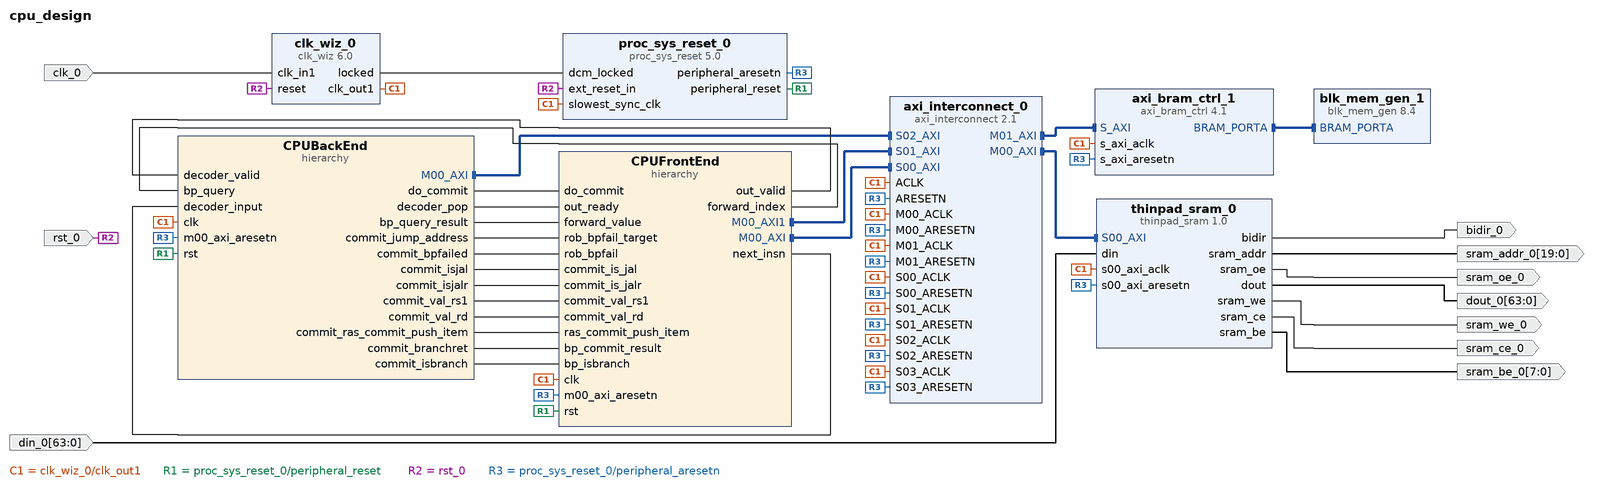
[diagram p0: block diagram of the top level]
# Vivado block design cpu_design, xc7a100tfgg676-2L, Vivado 2019.1
create_bd_design cpu_design

create_bd_port -dir I -type clk clk_0
set_property -dict {CONFIG.FREQ_HZ 50000000} [get_bd_ports clk_0]
create_bd_port -dir I -type rst rst_0
set_property -dict {CONFIG.POLARITY ACTIVE_HIGH} [get_bd_ports rst_0]
create_bd_port -dir O sram_oe_0
create_bd_port -dir O sram_we_0
create_bd_port -dir O -from 19 -to 0 sram_addr_0
create_bd_port -dir O bidir_0
create_bd_port -dir O sram_ce_0
create_bd_port -dir O -from 63 -to 0 dout_0
create_bd_port -dir O -from 7 -to 0 sram_be_0
create_bd_port -dir I -from 63 -to 0 din_0

create_bd_cell -type ip -vlnv xilinx.com:ip:clk_wiz:6.0 clk_wiz_0
set_property -dict [list \
  CONFIG.CLKIN1_JITTER_PS 200.0 \
  CONFIG.CLKOUT1_JITTER 162.035 \
  CONFIG.CLKOUT1_PHASE_ERROR 164.985 \
  CONFIG.MMCM_CLKFBOUT_MULT_F 20.000 \
  CONFIG.MMCM_CLKIN1_PERIOD 20.000 \
  CONFIG.MMCM_CLKIN2_PERIOD 10.0 \
  CONFIG.PRIM_IN_FREQ 50.000 \
] [get_bd_cells clk_wiz_0]
create_bd_cell -type ip -vlnv xilinx.com:ip:proc_sys_reset:5.0 proc_sys_reset_0
create_bd_cell -type hier CPUFrontEnd
create_bd_cell -type hier CPUBackEnd
create_bd_cell -type ip -vlnv xilinx.com:ip:axi_bram_ctrl:4.1 axi_bram_ctrl_1
set_property -dict {CONFIG.DATA_WIDTH 64 CONFIG.SINGLE_PORT_BRAM 1} [get_bd_cells axi_bram_ctrl_1]
create_bd_cell -type ip -vlnv xilinx.com:ip:blk_mem_gen:8.4 blk_mem_gen_1
set_property -dict [list \
  CONFIG.Load_Init_File false \
  CONFIG.Memory_Type Single_Port_ROM \
  CONFIG.Port_A_Write_Rate 0 \
] [get_bd_cells blk_mem_gen_1]
create_bd_cell -type ip -vlnv xilinx.com:ip:axi_interconnect:2.1 axi_interconnect_0
set_property -dict {CONFIG.NUM_MI 2 CONFIG.NUM_SI 4} [get_bd_cells axi_interconnect_0]
create_bd_cell -type ip -vlnv xilinx.com:user:thinpad_sram:1.0 thinpad_sram_0

# ---- hierarchy /CPUFrontEnd ----
current_bd_instance /CPUFrontEnd
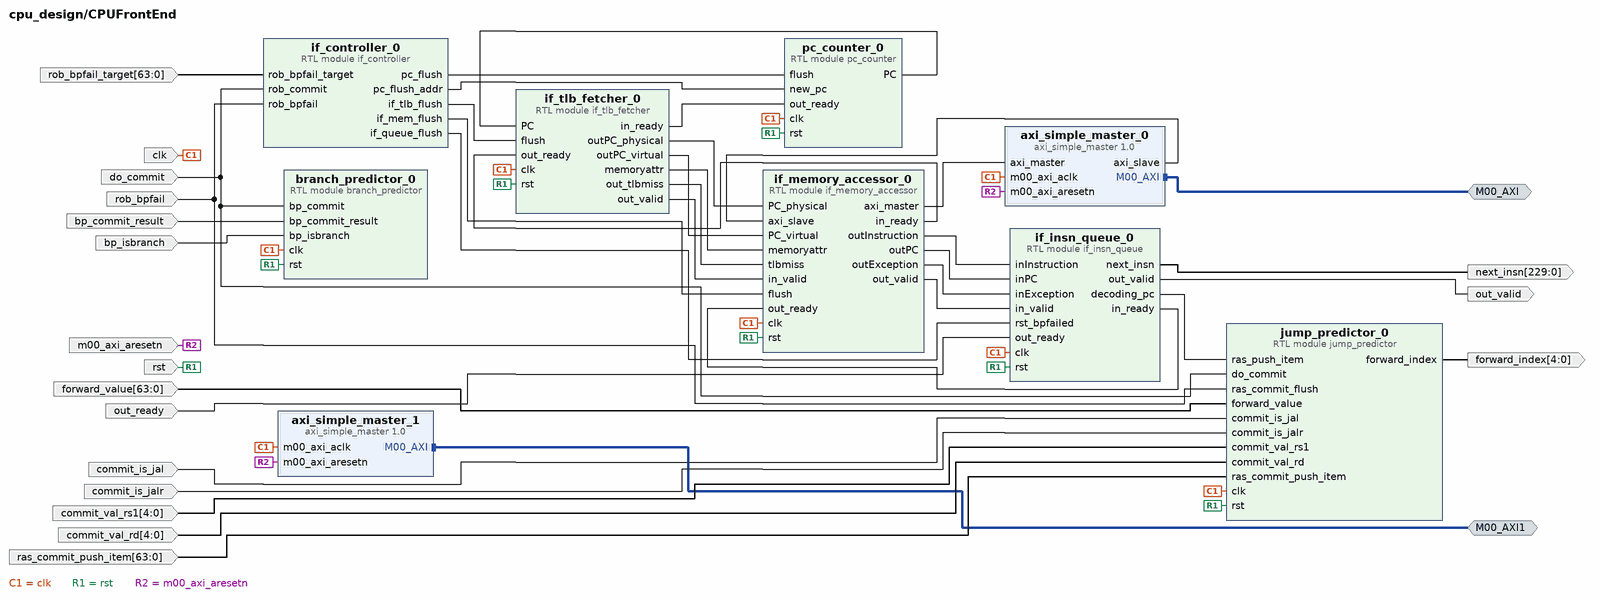
[diagram p1: block diagram inside /CPUFrontEnd]
create_bd_intf_pin -mode Master -vlnv xilinx.com:interface:aximm_rtl:1.0 M00_AXI1
create_bd_intf_pin -mode Master -vlnv xilinx.com:interface:aximm_rtl:1.0 M00_AXI
create_bd_pin -dir I do_commit
create_bd_pin -dir I rob_bpfail
create_bd_pin -dir I -from 63 -to 0 rob_bpfail_target
create_bd_pin -dir I -type clk clk
create_bd_pin -dir I -type rst rst
create_bd_pin -dir O -from 4 -to 0 forward_index
create_bd_pin -dir I -from 63 -to 0 forward_value
create_bd_pin -dir O out_valid
create_bd_pin -dir I out_ready
create_bd_pin -dir O -from 229 -to 0 next_insn
create_bd_pin -dir I -type rst m00_axi_aresetn
create_bd_pin -dir I commit_is_jal
create_bd_pin -dir I commit_is_jalr
create_bd_pin -dir I -from 4 -to 0 commit_val_rs1
create_bd_pin -dir I -from 4 -to 0 commit_val_rd
create_bd_pin -dir I -from 63 -to 0 ras_commit_push_item
create_bd_pin -dir I bp_commit_result
create_bd_pin -dir I bp_isbranch

create_bd_cell -type ip -vlnv xilinx.com:user:axi_simple_master:1.0 axi_simple_master_0
create_bd_cell -type ip -vlnv xilinx.com:user:axi_simple_master:1.0 axi_simple_master_1
create_bd_cell -type module -reference pc_counter pc_counter_0
create_bd_cell -type module -reference if_tlb_fetcher if_tlb_fetcher_0
create_bd_cell -type module -reference if_memory_accessor if_memory_accessor_0
create_bd_cell -type module -reference if_insn_queue if_insn_queue_0
create_bd_cell -type module -reference jump_predictor jump_predictor_0
create_bd_cell -type module -reference branch_predictor branch_predictor_0
create_bd_cell -type module -reference if_controller if_controller_0

# ---- hierarchy /CPUBackEnd ----
current_bd_instance /CPUBackEnd
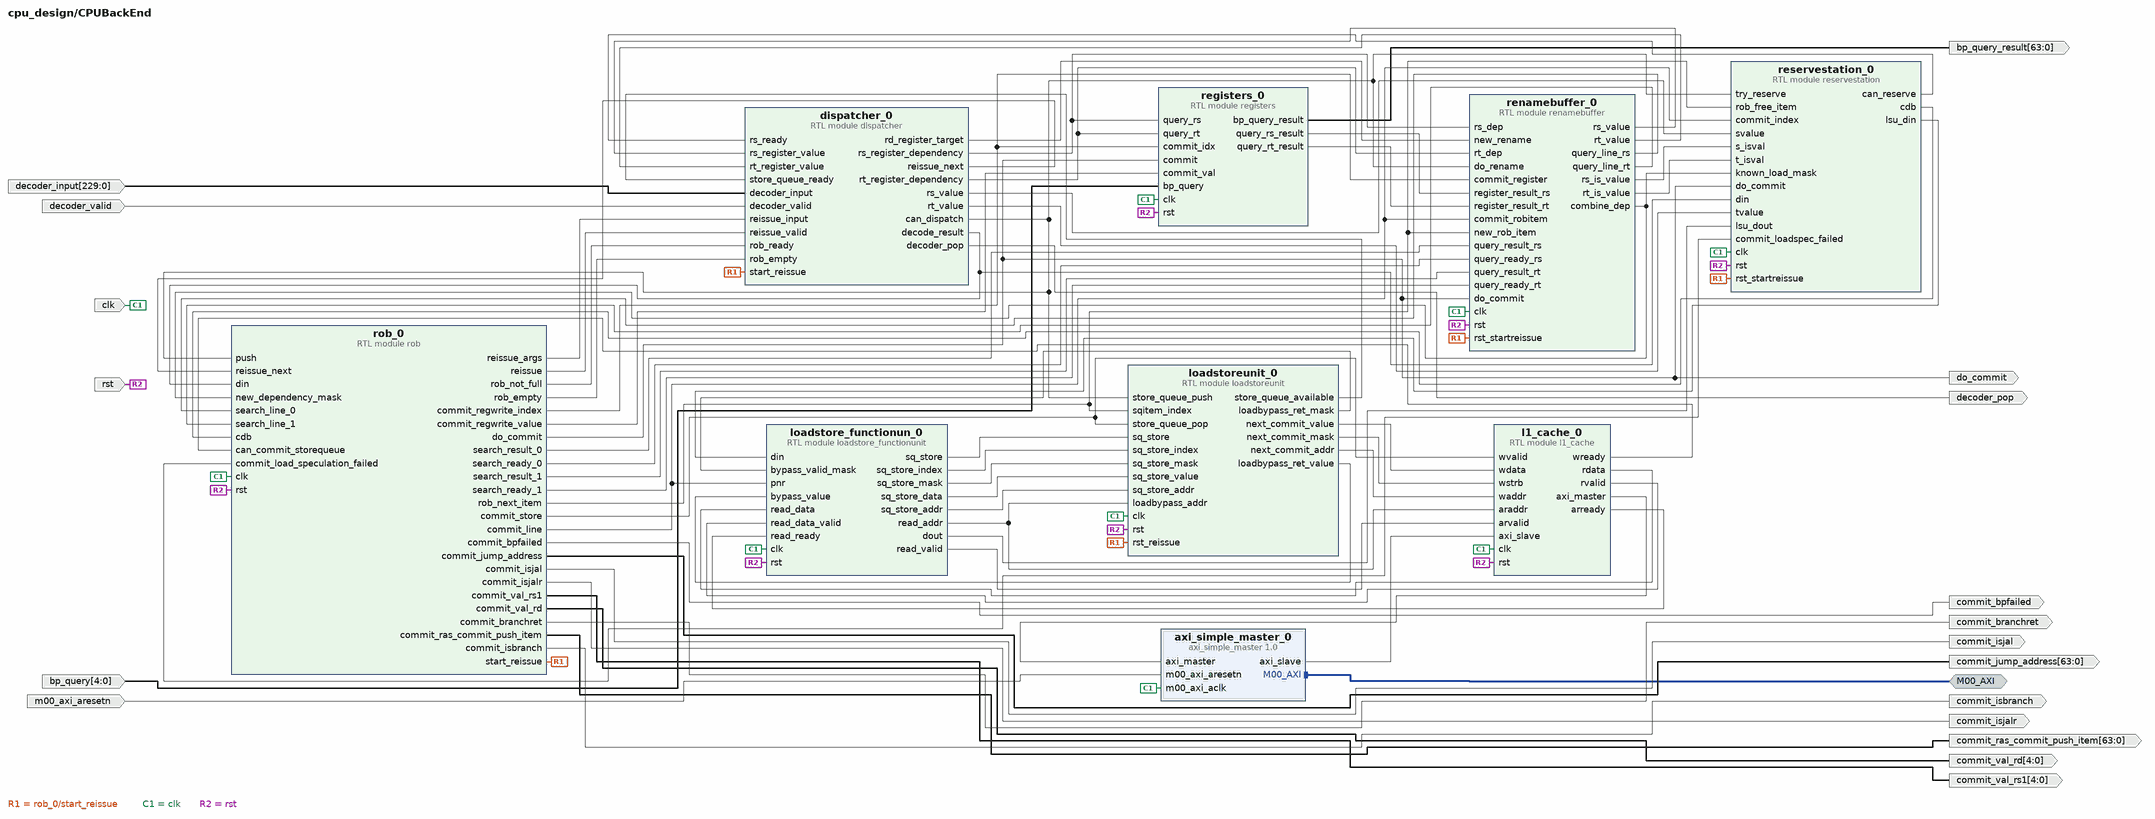
[diagram p2: block diagram inside /CPUBackEnd]
create_bd_intf_pin -mode Master -vlnv xilinx.com:interface:aximm_rtl:1.0 M00_AXI
create_bd_pin -dir I -from 229 -to 0 decoder_input
create_bd_pin -dir I decoder_valid
create_bd_pin -dir O decoder_pop
create_bd_pin -dir I -type clk clk
create_bd_pin -dir I -type rst rst
create_bd_pin -dir O do_commit
create_bd_pin -dir I -from 4 -to 0 bp_query
create_bd_pin -dir O -from 63 -to 0 bp_query_result
create_bd_pin -dir O -from 63 -to 0 commit_jump_address
create_bd_pin -dir O commit_bpfailed
create_bd_pin -dir I -type rst m00_axi_aresetn
create_bd_pin -dir O commit_isjal
create_bd_pin -dir O commit_isjalr
create_bd_pin -dir O -from 4 -to 0 commit_val_rs1
create_bd_pin -dir O -from 4 -to 0 commit_val_rd
create_bd_pin -dir O -from 63 -to 0 commit_ras_commit_push_item
create_bd_pin -dir O commit_branchret
create_bd_pin -dir O commit_isbranch

create_bd_cell -type ip -vlnv xilinx.com:user:axi_simple_master:1.0 axi_simple_master_0
create_bd_cell -type module -reference dispatcher dispatcher_0
create_bd_cell -type module -reference l1_cache l1_cache_0
create_bd_cell -type module -reference loadstoreunit loadstoreunit_0
create_bd_cell -type module -reference registers registers_0
create_bd_cell -type module -reference renamebuffer renamebuffer_0
create_bd_cell -type module -reference rob rob_0
create_bd_cell -type module -reference reservestation reservestation_0
create_bd_cell -type module -reference loadstore_functionunit loadstore_functionun_0

# ---- connections ----

current_bd_instance /CPUFrontEnd
connect_bd_intf_net [get_bd_intf_pins M00_AXI] [get_bd_intf_pins axi_simple_master_0/M00_AXI]
connect_bd_intf_net [get_bd_intf_pins M00_AXI1] [get_bd_intf_pins axi_simple_master_1/M00_AXI]
connect_bd_net [get_bd_pins if_controller_0/pc_flush] [get_bd_pins pc_counter_0/flush]
connect_bd_net [get_bd_pins if_controller_0/pc_flush_addr] [get_bd_pins pc_counter_0/new_pc]
connect_bd_net [get_bd_pins if_controller_0/if_tlb_flush] [get_bd_pins if_tlb_fetcher_0/flush]
connect_bd_net [get_bd_pins if_controller_0/if_mem_flush] [get_bd_pins if_memory_accessor_0/flush]
connect_bd_net [get_bd_pins if_controller_0/if_queue_flush] [get_bd_pins if_insn_queue_0/rst_bpfailed]
connect_bd_net [get_bd_pins pc_counter_0/PC] [get_bd_pins if_tlb_fetcher_0/PC]
connect_bd_net [get_bd_pins if_tlb_fetcher_0/outPC_physical] [get_bd_pins if_memory_accessor_0/PC_physical]
connect_bd_net [get_bd_pins if_tlb_fetcher_0/outPC_virtual] [get_bd_pins if_memory_accessor_0/PC_virtual]
connect_bd_net [get_bd_pins if_tlb_fetcher_0/memoryattr] [get_bd_pins if_memory_accessor_0/memoryattr]
connect_bd_net [get_bd_pins if_tlb_fetcher_0/out_tlbmiss] [get_bd_pins if_memory_accessor_0/tlbmiss]
connect_bd_net [get_bd_pins if_tlb_fetcher_0/in_ready] [get_bd_pins pc_counter_0/out_ready]
connect_bd_net [get_bd_pins if_tlb_fetcher_0/out_valid] [get_bd_pins if_memory_accessor_0/in_valid]
connect_bd_net [get_bd_pins if_memory_accessor_0/in_ready] [get_bd_pins if_tlb_fetcher_0/out_ready]
connect_bd_net [get_bd_pins if_memory_accessor_0/outInstruction] [get_bd_pins if_insn_queue_0/inInstruction]
connect_bd_net [get_bd_pins if_memory_accessor_0/outPC] [get_bd_pins if_insn_queue_0/inPC]
connect_bd_net [get_bd_pins if_memory_accessor_0/outException] [get_bd_pins if_insn_queue_0/inException]
connect_bd_net [get_bd_pins if_memory_accessor_0/out_valid] [get_bd_pins if_insn_queue_0/in_valid]
connect_bd_net [get_bd_pins if_insn_queue_0/in_ready] [get_bd_pins if_memory_accessor_0/out_ready]
connect_bd_net -net rob_0_do_commit [get_bd_pins do_commit] \
  [get_bd_pins jump_predictor_0/do_commit] [get_bd_pins branch_predictor_0/bp_commit] \
  [get_bd_pins if_controller_0/rob_commit]
connect_bd_net -net rob_0_commit_bpfailed [get_bd_pins rob_bpfail] \
  [get_bd_pins jump_predictor_0/ras_commit_flush] [get_bd_pins if_controller_0/rob_bpfail]
connect_bd_net -net rob_0_commit_jump_address [get_bd_pins rob_bpfail_target] [get_bd_pins if_controller_0/rob_bpfail_target]
connect_bd_net -net clk_0_1 [get_bd_pins clk] \
  [get_bd_pins axi_simple_master_0/m00_axi_aclk] [get_bd_pins axi_simple_master_1/m00_axi_aclk] \
  [get_bd_pins pc_counter_0/clk] [get_bd_pins if_tlb_fetcher_0/clk] [get_bd_pins if_memory_accessor_0/clk] \
  [get_bd_pins if_insn_queue_0/clk] [get_bd_pins jump_predictor_0/clk] [get_bd_pins branch_predictor_0/clk]
connect_bd_net -net rst_0_1 [get_bd_pins rst] \
  [get_bd_pins pc_counter_0/rst] [get_bd_pins if_tlb_fetcher_0/rst] [get_bd_pins if_memory_accessor_0/rst] \
  [get_bd_pins if_insn_queue_0/rst] [get_bd_pins jump_predictor_0/rst] [get_bd_pins branch_predictor_0/rst]
connect_bd_net [get_bd_pins jump_predictor_0/forward_index] [get_bd_pins forward_index]
connect_bd_net -net registers_0_bp_query_result [get_bd_pins forward_value] [get_bd_pins jump_predictor_0/forward_value]
connect_bd_net [get_bd_pins if_insn_queue_0/out_valid] [get_bd_pins out_valid]
connect_bd_net -net dispatcher_0_decoder_pop [get_bd_pins out_ready] [get_bd_pins if_insn_queue_0/out_ready]
connect_bd_net [get_bd_pins if_insn_queue_0/next_insn] [get_bd_pins next_insn]
connect_bd_net [get_bd_pins m00_axi_aresetn] [get_bd_pins axi_simple_master_0/m00_axi_aresetn] [get_bd_pins axi_simple_master_1/m00_axi_aresetn]
connect_bd_net [get_bd_pins if_memory_accessor_0/axi_master] [get_bd_pins axi_simple_master_0/axi_master]
connect_bd_net [get_bd_pins axi_simple_master_0/axi_slave] [get_bd_pins if_memory_accessor_0/axi_slave]
connect_bd_net [get_bd_pins commit_is_jal] [get_bd_pins jump_predictor_0/commit_is_jal]
connect_bd_net [get_bd_pins commit_is_jalr] [get_bd_pins jump_predictor_0/commit_is_jalr]
connect_bd_net -net commit_val_rs1_1 [get_bd_pins commit_val_rs1] [get_bd_pins jump_predictor_0/commit_val_rs1]
connect_bd_net [get_bd_pins commit_val_rd] [get_bd_pins jump_predictor_0/commit_val_rd]
connect_bd_net [get_bd_pins ras_commit_push_item] [get_bd_pins jump_predictor_0/ras_commit_push_item]
connect_bd_net [get_bd_pins bp_commit_result] [get_bd_pins branch_predictor_0/bp_commit_result]
connect_bd_net [get_bd_pins bp_isbranch] [get_bd_pins branch_predictor_0/bp_isbranch]
connect_bd_net [get_bd_pins if_insn_queue_0/decoding_pc] [get_bd_pins jump_predictor_0/ras_push_item]

current_bd_instance /CPUBackEnd
connect_bd_intf_net [get_bd_intf_pins M00_AXI] [get_bd_intf_pins axi_simple_master_0/M00_AXI]
connect_bd_net [get_bd_pins rob_0/reissue_args] [get_bd_pins dispatcher_0/reissue_input]
connect_bd_net [get_bd_pins rob_0/reissue] [get_bd_pins dispatcher_0/reissue_valid]
connect_bd_net [get_bd_pins dispatcher_0/reissue_next] [get_bd_pins rob_0/reissue_next]
connect_bd_net [get_bd_pins dispatcher_0/can_dispatch] \
  [get_bd_pins loadstoreunit_0/store_queue_push] [get_bd_pins renamebuffer_0/do_rename] [get_bd_pins rob_0/push] \
  [get_bd_pins reservestation_0/try_reserve]
connect_bd_net [get_bd_pins rob_0/rob_not_full] [get_bd_pins dispatcher_0/rob_ready]
connect_bd_net [get_bd_pins reservestation_0/can_reserve] [get_bd_pins dispatcher_0/rs_ready]
connect_bd_net [get_bd_pins dispatcher_0/decode_result] [get_bd_pins rob_0/din] [get_bd_pins reservestation_0/din]
connect_bd_net [get_bd_pins dispatcher_0/rs_register_dependency] [get_bd_pins registers_0/query_rs] [get_bd_pins renamebuffer_0/rs_dep]
connect_bd_net [get_bd_pins dispatcher_0/rt_register_dependency] [get_bd_pins registers_0/query_rt] [get_bd_pins renamebuffer_0/rt_dep]
connect_bd_net [get_bd_pins dispatcher_0/rd_register_target] [get_bd_pins renamebuffer_0/new_rename]
connect_bd_net [get_bd_pins renamebuffer_0/rs_value] [get_bd_pins dispatcher_0/rs_register_value]
connect_bd_net [get_bd_pins renamebuffer_0/rt_value] [get_bd_pins dispatcher_0/rt_register_value]
connect_bd_net [get_bd_pins dispatcher_0/rs_value] [get_bd_pins reservestation_0/svalue]
connect_bd_net [get_bd_pins dispatcher_0/rt_value] [get_bd_pins reservestation_0/tvalue]
connect_bd_net [get_bd_pins rob_0/start_reissue] \
  [get_bd_pins dispatcher_0/start_reissue] [get_bd_pins loadstoreunit_0/rst_reissue] \
  [get_bd_pins renamebuffer_0/rst_startreissue] [get_bd_pins reservestation_0/rst_startreissue]
connect_bd_net [get_bd_pins rob_0/rob_empty] [get_bd_pins dispatcher_0/rob_empty]
connect_bd_net [get_bd_pins loadstoreunit_0/store_queue_available] [get_bd_pins dispatcher_0/store_queue_ready]
connect_bd_net [get_bd_pins registers_0/query_rs_result] [get_bd_pins renamebuffer_0/register_result_rs]
connect_bd_net [get_bd_pins registers_0/query_rt_result] [get_bd_pins renamebuffer_0/register_result_rt]
connect_bd_net [get_bd_pins rob_0/commit_regwrite_index] [get_bd_pins registers_0/commit_idx] [get_bd_pins renamebuffer_0/commit_register]
connect_bd_net [get_bd_pins rob_0/commit_regwrite_value] [get_bd_pins registers_0/commit_val]
connect_bd_net [get_bd_pins rob_0/rob_next_item] \
  [get_bd_pins loadstoreunit_0/sqitem_index] [get_bd_pins renamebuffer_0/new_rob_item] \
  [get_bd_pins reservestation_0/rob_free_item]
connect_bd_net [get_bd_pins rob_0/commit_line] \
  [get_bd_pins renamebuffer_0/commit_robitem] [get_bd_pins reservestation_0/commit_index] \
  [get_bd_pins loadstore_functionun_0/pnr]
connect_bd_net [get_bd_pins renamebuffer_0/combine_dep] [get_bd_pins rob_0/new_dependency_mask] [get_bd_pins reservestation_0/known_load_mask]
connect_bd_net [get_bd_pins renamebuffer_0/rs_is_value] [get_bd_pins reservestation_0/s_isval]
connect_bd_net [get_bd_pins renamebuffer_0/rt_is_value] [get_bd_pins reservestation_0/t_isval]
connect_bd_net [get_bd_pins renamebuffer_0/query_line_rs] [get_bd_pins rob_0/search_line_0]
connect_bd_net [get_bd_pins rob_0/search_result_0] [get_bd_pins renamebuffer_0/query_result_rs]
connect_bd_net [get_bd_pins rob_0/search_ready_0] [get_bd_pins renamebuffer_0/query_ready_rs]
connect_bd_net [get_bd_pins renamebuffer_0/query_line_rt] [get_bd_pins rob_0/search_line_1]
connect_bd_net [get_bd_pins rob_0/search_result_1] [get_bd_pins renamebuffer_0/query_result_rt]
connect_bd_net [get_bd_pins rob_0/search_ready_1] [get_bd_pins renamebuffer_0/query_ready_rt]
connect_bd_net [get_bd_pins reservestation_0/cdb] [get_bd_pins rob_0/cdb]
connect_bd_net [get_bd_pins rob_0/commit_store] [get_bd_pins l1_cache_0/wvalid] [get_bd_pins loadstoreunit_0/store_queue_pop]
connect_bd_net -net if_insn_queue_0_next_insn [get_bd_pins decoder_input] [get_bd_pins dispatcher_0/decoder_input]
connect_bd_net -net if_insn_queue_0_out_valid [get_bd_pins decoder_valid] [get_bd_pins dispatcher_0/decoder_valid]
connect_bd_net [get_bd_pins dispatcher_0/decoder_pop] [get_bd_pins decoder_pop]
connect_bd_net -net clk_0_1 [get_bd_pins clk] \
  [get_bd_pins axi_simple_master_0/m00_axi_aclk] [get_bd_pins l1_cache_0/clk] [get_bd_pins loadstoreunit_0/clk] \
  [get_bd_pins registers_0/clk] [get_bd_pins renamebuffer_0/clk] [get_bd_pins rob_0/clk] [get_bd_pins reservestation_0/clk] \
  [get_bd_pins loadstore_functionun_0/clk]
connect_bd_net -net rst_0_1 [get_bd_pins rst] \
  [get_bd_pins l1_cache_0/rst] [get_bd_pins loadstoreunit_0/rst] [get_bd_pins registers_0/rst] \
  [get_bd_pins renamebuffer_0/rst] [get_bd_pins rob_0/rst] [get_bd_pins reservestation_0/rst] \
  [get_bd_pins loadstore_functionun_0/rst]
connect_bd_net [get_bd_pins rob_0/do_commit] \
  [get_bd_pins do_commit] [get_bd_pins registers_0/commit] [get_bd_pins renamebuffer_0/do_commit] \
  [get_bd_pins reservestation_0/do_commit]
connect_bd_net -net jump_predictor_0_forward_index [get_bd_pins bp_query] [get_bd_pins registers_0/bp_query]
connect_bd_net [get_bd_pins registers_0/bp_query_result] [get_bd_pins bp_query_result]
connect_bd_net [get_bd_pins rob_0/commit_jump_address] [get_bd_pins commit_jump_address]
connect_bd_net [get_bd_pins rob_0/commit_bpfailed] [get_bd_pins commit_bpfailed]
connect_bd_net [get_bd_pins loadstoreunit_0/next_commit_value] [get_bd_pins l1_cache_0/wdata]
connect_bd_net [get_bd_pins loadstoreunit_0/next_commit_mask] [get_bd_pins l1_cache_0/wstrb]
connect_bd_net [get_bd_pins loadstoreunit_0/next_commit_addr] [get_bd_pins l1_cache_0/waddr]
connect_bd_net [get_bd_pins m00_axi_aresetn] [get_bd_pins axi_simple_master_0/m00_axi_aresetn]
connect_bd_net [get_bd_pins axi_simple_master_0/axi_slave] [get_bd_pins l1_cache_0/axi_slave]
connect_bd_net [get_bd_pins l1_cache_0/axi_master] [get_bd_pins axi_simple_master_0/axi_master]
connect_bd_net [get_bd_pins l1_cache_0/wready] [get_bd_pins rob_0/can_commit_storequeue]
connect_bd_net [get_bd_pins reservestation_0/lsu_din] [get_bd_pins loadstore_functionun_0/din]
connect_bd_net [get_bd_pins loadstore_functionun_0/dout] [get_bd_pins reservestation_0/lsu_dout]
connect_bd_net [get_bd_pins loadstoreunit_0/loadbypass_ret_mask] [get_bd_pins loadstore_functionun_0/bypass_valid_mask]
connect_bd_net [get_bd_pins loadstoreunit_0/loadbypass_ret_value] [get_bd_pins loadstore_functionun_0/bypass_value]
connect_bd_net [get_bd_pins l1_cache_0/rdata] [get_bd_pins loadstore_functionun_0/read_data]
connect_bd_net [get_bd_pins l1_cache_0/rvalid] [get_bd_pins loadstore_functionun_0/read_data_valid]
connect_bd_net [get_bd_pins l1_cache_0/arready] [get_bd_pins loadstore_functionun_0/read_ready]
connect_bd_net [get_bd_pins loadstore_functionun_0/read_valid] [get_bd_pins l1_cache_0/arvalid]
connect_bd_net [get_bd_pins loadstore_functionun_0/read_addr] [get_bd_pins l1_cache_0/araddr] [get_bd_pins loadstoreunit_0/loadbypass_addr]
connect_bd_net [get_bd_pins loadstore_functionun_0/sq_store] [get_bd_pins loadstoreunit_0/sq_store]
connect_bd_net [get_bd_pins loadstore_functionun_0/sq_store_index] [get_bd_pins loadstoreunit_0/sq_store_index]
connect_bd_net [get_bd_pins loadstore_functionun_0/sq_store_mask] [get_bd_pins loadstoreunit_0/sq_store_mask]
connect_bd_net [get_bd_pins loadstore_functionun_0/sq_store_data] [get_bd_pins loadstoreunit_0/sq_store_value]
connect_bd_net [get_bd_pins loadstore_functionun_0/sq_store_addr] [get_bd_pins loadstoreunit_0/sq_store_addr]
connect_bd_net [get_bd_pins rob_0/commit_isjal] [get_bd_pins commit_isjal]
connect_bd_net [get_bd_pins rob_0/commit_isjalr] [get_bd_pins commit_isjalr]
connect_bd_net [get_bd_pins rob_0/commit_val_rs1] [get_bd_pins commit_val_rs1]
connect_bd_net [get_bd_pins rob_0/commit_val_rd] [get_bd_pins commit_val_rd]
connect_bd_net [get_bd_pins rob_0/commit_ras_commit_push_item] [get_bd_pins commit_ras_commit_push_item]
connect_bd_net [get_bd_pins rob_0/commit_branchret] [get_bd_pins commit_branchret]
connect_bd_net [get_bd_pins rob_0/commit_isbranch] [get_bd_pins commit_isbranch]
connect_bd_net [get_bd_pins rob_0/commit_load_speculation_failed] [get_bd_pins reservestation_0/commit_loadspec_failed]

current_bd_instance /
connect_bd_intf_net [get_bd_intf_pins CPUFrontEnd/M00_AXI1] [get_bd_intf_pins axi_interconnect_0/S01_AXI]
connect_bd_intf_net [get_bd_intf_pins blk_mem_gen_1/BRAM_PORTA] [get_bd_intf_pins axi_bram_ctrl_1/BRAM_PORTA]
connect_bd_intf_net [get_bd_intf_pins axi_interconnect_0/M01_AXI] [get_bd_intf_pins axi_bram_ctrl_1/S_AXI]
connect_bd_intf_net [get_bd_intf_pins axi_interconnect_0/M00_AXI] [get_bd_intf_pins thinpad_sram_0/S00_AXI]
connect_bd_intf_net [get_bd_intf_pins CPUFrontEnd/M00_AXI] [get_bd_intf_pins axi_interconnect_0/S00_AXI]
connect_bd_intf_net [get_bd_intf_pins CPUBackEnd/M00_AXI] [get_bd_intf_pins axi_interconnect_0/S02_AXI]
connect_bd_net -net clk_0_1 [get_bd_pins clk_wiz_0/clk_out1] \
  [get_bd_pins proc_sys_reset_0/slowest_sync_clk] [get_bd_pins CPUFrontEnd/clk] [get_bd_pins CPUBackEnd/clk] \
  [get_bd_pins axi_bram_ctrl_1/s_axi_aclk] [get_bd_pins axi_interconnect_0/ACLK] [get_bd_pins axi_interconnect_0/S00_ACLK] \
  [get_bd_pins axi_interconnect_0/M00_ACLK] [get_bd_pins axi_interconnect_0/M01_ACLK] \
  [get_bd_pins axi_interconnect_0/S01_ACLK] [get_bd_pins axi_interconnect_0/S02_ACLK] \
  [get_bd_pins axi_interconnect_0/S03_ACLK] [get_bd_pins thinpad_sram_0/s00_axi_aclk]
connect_bd_net -net rst_0_1 [get_bd_pins proc_sys_reset_0/peripheral_reset] [get_bd_pins CPUFrontEnd/rst] [get_bd_pins CPUBackEnd/rst]
connect_bd_net -net rob_0_do_commit [get_bd_pins CPUBackEnd/do_commit] [get_bd_pins CPUFrontEnd/do_commit]
connect_bd_net -net dispatcher_0_decoder_pop [get_bd_pins CPUBackEnd/decoder_pop] [get_bd_pins CPUFrontEnd/out_ready]
connect_bd_net -net if_insn_queue_0_out_valid [get_bd_pins CPUFrontEnd/out_valid] [get_bd_pins CPUBackEnd/decoder_valid]
connect_bd_net -net jump_predictor_0_forward_index [get_bd_pins CPUFrontEnd/forward_index] [get_bd_pins CPUBackEnd/bp_query]
connect_bd_net -net registers_0_bp_query_result [get_bd_pins CPUBackEnd/bp_query_result] [get_bd_pins CPUFrontEnd/forward_value]
connect_bd_net -net if_insn_queue_0_next_insn [get_bd_pins CPUFrontEnd/next_insn] [get_bd_pins CPUBackEnd/decoder_input]
connect_bd_net -net rob_0_commit_jump_address [get_bd_pins CPUBackEnd/commit_jump_address] [get_bd_pins CPUFrontEnd/rob_bpfail_target]
connect_bd_net -net rob_0_commit_bpfailed [get_bd_pins CPUBackEnd/commit_bpfailed] [get_bd_pins CPUFrontEnd/rob_bpfail]
connect_bd_net -net rst_0_2 [get_bd_ports rst_0] [get_bd_pins proc_sys_reset_0/ext_reset_in] [get_bd_pins clk_wiz_0/reset]
connect_bd_net -net clk_0_2 [get_bd_ports clk_0] [get_bd_pins clk_wiz_0/clk_in1]
connect_bd_net [get_bd_pins clk_wiz_0/locked] [get_bd_pins proc_sys_reset_0/dcm_locked]
connect_bd_net [get_bd_pins proc_sys_reset_0/peripheral_aresetn] \
  [get_bd_pins CPUFrontEnd/m00_axi_aresetn] [get_bd_pins CPUBackEnd/m00_axi_aresetn] \
  [get_bd_pins axi_bram_ctrl_1/s_axi_aresetn] [get_bd_pins axi_interconnect_0/ARESETN] \
  [get_bd_pins axi_interconnect_0/S00_ARESETN] [get_bd_pins axi_interconnect_0/M00_ARESETN] \
  [get_bd_pins axi_interconnect_0/M01_ARESETN] [get_bd_pins axi_interconnect_0/S01_ARESETN] \
  [get_bd_pins axi_interconnect_0/S02_ARESETN] [get_bd_pins axi_interconnect_0/S03_ARESETN] \
  [get_bd_pins thinpad_sram_0/s00_axi_aresetn]
connect_bd_net [get_bd_pins CPUBackEnd/commit_isjal] [get_bd_pins CPUFrontEnd/commit_is_jal]
connect_bd_net -net commit_is_jalr_1 [get_bd_pins CPUBackEnd/commit_isjalr] [get_bd_pins CPUFrontEnd/commit_is_jalr]
connect_bd_net [get_bd_pins CPUBackEnd/commit_val_rs1] [get_bd_pins CPUFrontEnd/commit_val_rs1]
connect_bd_net -net commit_val_rd_1 [get_bd_pins CPUBackEnd/commit_val_rd] [get_bd_pins CPUFrontEnd/commit_val_rd]
connect_bd_net [get_bd_pins CPUBackEnd/commit_ras_commit_push_item] [get_bd_pins CPUFrontEnd/ras_commit_push_item]
connect_bd_net [get_bd_pins CPUBackEnd/commit_branchret] [get_bd_pins CPUFrontEnd/bp_commit_result]
connect_bd_net -net bp_isbranch_1 [get_bd_pins CPUBackEnd/commit_isbranch] [get_bd_pins CPUFrontEnd/bp_isbranch]
connect_bd_net [get_bd_pins thinpad_sram_0/sram_oe] [get_bd_ports sram_oe_0]
connect_bd_net [get_bd_pins thinpad_sram_0/sram_we] [get_bd_ports sram_we_0]
connect_bd_net [get_bd_pins thinpad_sram_0/sram_addr] [get_bd_ports sram_addr_0]
connect_bd_net [get_bd_pins thinpad_sram_0/bidir] [get_bd_ports bidir_0]
connect_bd_net [get_bd_pins thinpad_sram_0/sram_ce] [get_bd_ports sram_ce_0]
connect_bd_net [get_bd_pins thinpad_sram_0/dout] [get_bd_ports dout_0]
connect_bd_net [get_bd_pins thinpad_sram_0/sram_be] [get_bd_ports sram_be_0]
connect_bd_net -net din_0_1 [get_bd_ports din_0] [get_bd_pins thinpad_sram_0/din]

# ---- address map ----
assign_bd_address -offset 0x0000000080000000 -range 8M -target_address_space [get_bd_addr_spaces CPUBackEnd/axi_simple_master_0/M00_AXI] [get_bd_addr_segs thinpad_sram_0/S00_AXI/S00_AXI_mem]
assign_bd_address -offset 0x00000000C0000000 -range 8K -target_address_space [get_bd_addr_spaces CPUBackEnd/axi_simple_master_0/M00_AXI] [get_bd_addr_segs axi_bram_ctrl_1/S_AXI/Mem0]
assign_bd_address -offset 0x0000000080000000 -range 8M -target_address_space [get_bd_addr_spaces CPUFrontEnd/axi_simple_master_0/M00_AXI] [get_bd_addr_segs thinpad_sram_0/S00_AXI/S00_AXI_mem]
assign_bd_address -offset 0x00000000C0000000 -range 8K -target_address_space [get_bd_addr_spaces CPUFrontEnd/axi_simple_master_0/M00_AXI] [get_bd_addr_segs axi_bram_ctrl_1/S_AXI/Mem0]
assign_bd_address -offset 0x0000000080000000 -range 8M -target_address_space [get_bd_addr_spaces CPUFrontEnd/axi_simple_master_1/M00_AXI] [get_bd_addr_segs thinpad_sram_0/S00_AXI/S00_AXI_mem]
assign_bd_address -offset 0x00000000C0000000 -range 8K -target_address_space [get_bd_addr_spaces CPUFrontEnd/axi_simple_master_1/M00_AXI] [get_bd_addr_segs axi_bram_ctrl_1/S_AXI/Mem0]

validate_bd_design
save_bd_design
